# EAGLE design adpd2211_mixer (EAGLE 8.7.0)
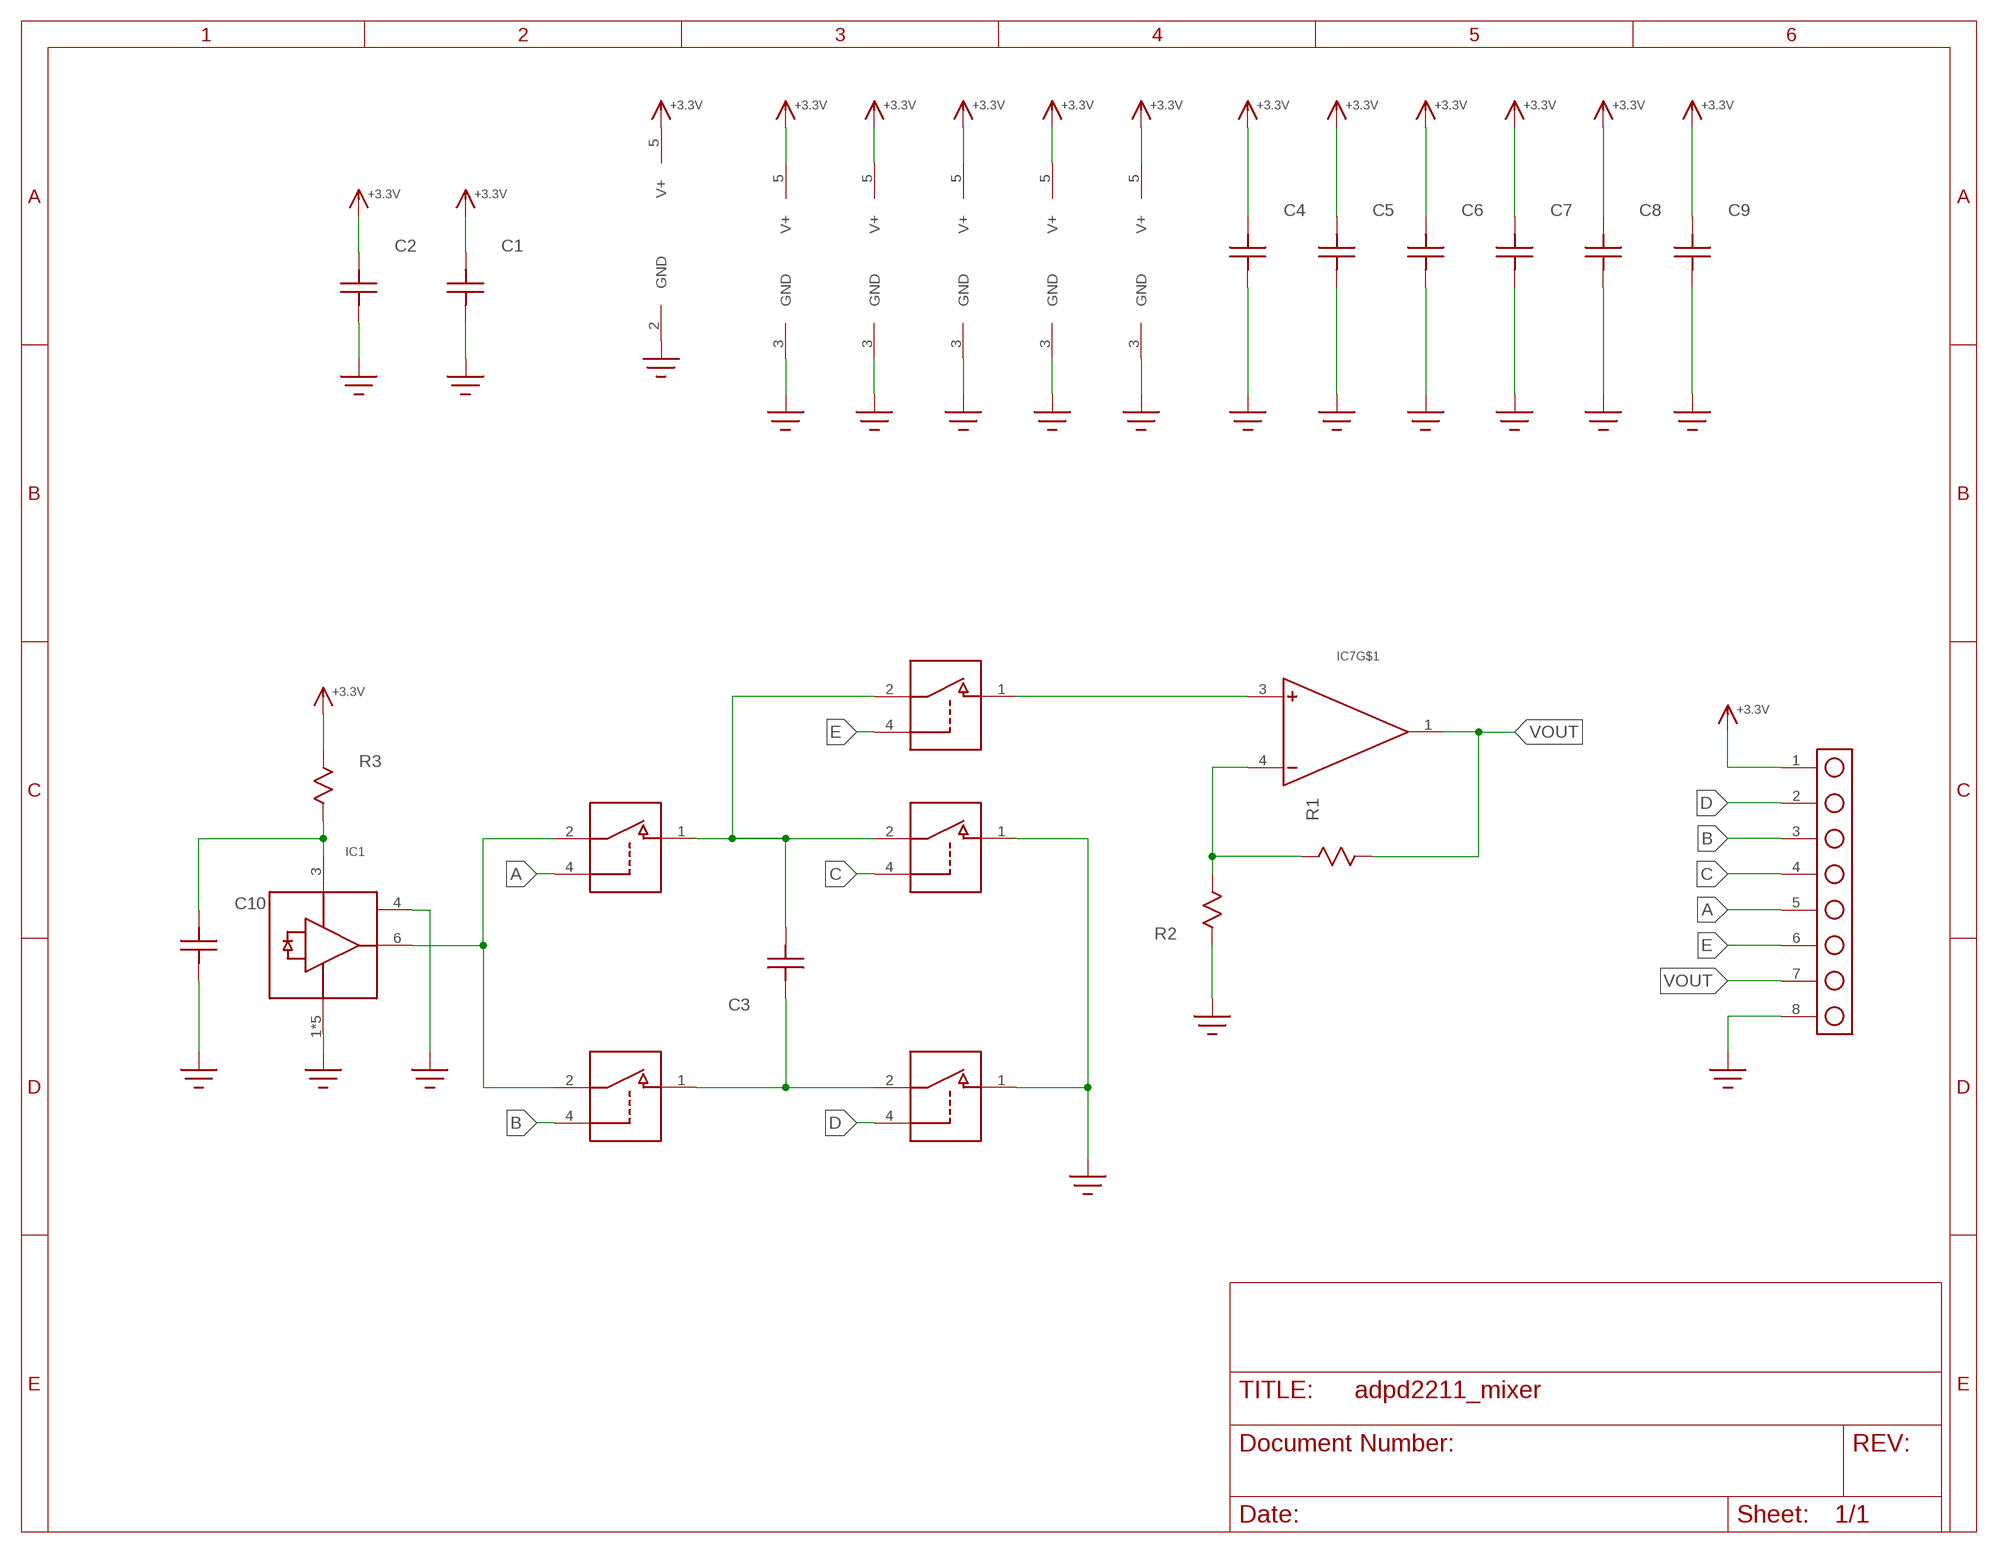
[diagram p0: schematic, sheet 1]

## Parts
C1  C1206  [1206]
C2  C0603  [C0603]
C3  C0805  [0805]
C4  C0603  [C0603]
C5  C0603  [C0603]
C6  C0603  [C0603]
C7  C0603  [C0603]
C8  C0603  [C0603]
C9  C0603  [C0603]
C10  C0603  [C0603]
IC1  ADPD2211  [LFCSP8]
IC2  TS5A3166  [SOT23-5]
IC3  TS5A3166  [SOT23-5]
IC4  TS5A3166  [SOT23-5]
IC5  TS5A3166  [SOT23-5]
IC6  TS5A3166  [SOT23-5]
IC7  AD8538  [SOT23-5]
J1  HEADER_8_PIN  [HEADER_8_PIN]
R1  R0603  [R0603]
R2  R0603  [R0603]
R3  R0603  [R0603]

## Nets
+3.3V: C1.P$2 C2.P$2 C4.P$2 C5.P$2 C6.P$2 C7.P$2 C8.P$2 C9.P$2 IC2.5(V+) IC3.5(V+) IC4.5(V+) IC5.5(V+) IC6.5(V+) IC7.5(V+) J1.1 R3.P$1
A: IC2.4(IN) J1.5
B: IC4.4(IN) J1.3
C: IC3.4(IN) J1.4
D: IC5.4(IN) J1.2
E: IC6.4(IN) J1.6
GND: C1.P$1 C2.P$1 C4.P$1 C5.P$1 C6.P$1 C7.P$1 C8.P$1 C9.P$1 C10.P$1 IC1.1(GND) IC1.2(GND) IC1.4(PWDN) IC1.5(GND) IC1.7(GND) IC1.8(GND) IC2.3(GND) IC3.1(NO) IC3.3(GND) IC4.3(GND) IC5.1(NO) IC5.3(GND) IC6.3(GND) IC7.2(GND) J1.8 R2.P$1
N$1: IC1.6(OUT) IC2.2(COM) IC4.2(COM)
N$2: C3.P$1 IC2.1(NO) IC3.2(COM) IC6.2(COM)
N$3: C3.P$2 IC4.1(NO) IC5.2(COM)
N$5: C10.P$2 IC1.3(VCC) R3.P$2
N$10: IC6.1(NO) IC7.3(+)
N$11: IC7.4(-) R1.P$1 R2.P$2
VOUT: IC7.1(OUT) J1.7 R1.P$2

## Library data of the parts
C1-C10 = ssir:C
IC1 = ssir:ADPD2211
IC2-IC6 = ssir:TS5A3166
IC7 = ssir:AD8538
J1 = ssir:HEADER_8_PIN
R1-R3 = ssir:R

## Board
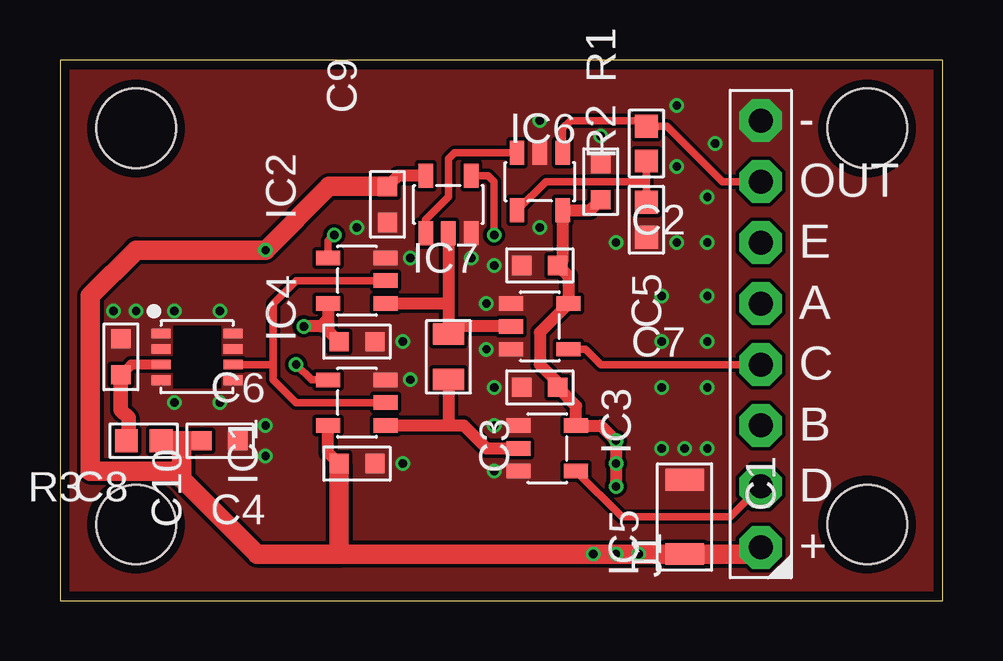
[diagram p1: board, top side]
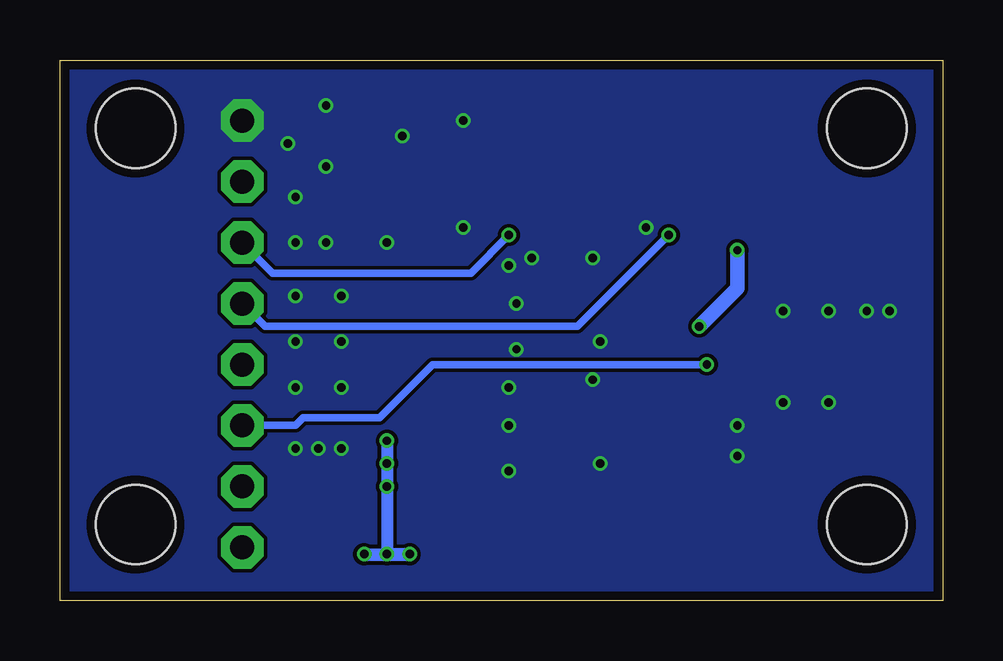
[diagram p2: board, bottom side, seen from below]

Size 36.81 x 22.53 mm. Coordinates in mm from the lower left corner, seen from the top.
Outline: 0,0 36.81,0 36.81,22.53 0,22.53 0,0
Copper layers (1*16): Top 0.035559375mm / dielectric 1.6mm / Bottom 0.035559375mm
Design rules "oshpark-2layer": minimum track width 6mil, minimum drill 10mil, track to track 6mil, track to pad 6mil, pad to pad 6mil, via to via 6mil, smd to smd 6mil, copper to edge 15mil, drill to drill 6mil, minimum pad ring 5mil, minimum via ring 5mil, stop-mask expansion 2.5mil, vias tented up to drill 0mil, thermal gap 10mil
Holes 3.3 mm at 3.17,3.17 3.17,19.68 33.66,19.68 33.66,3.17

### Footprints (pad centres in the part's own frame; a part is rotated, then mirrored left to right if it is on the bottom)
1206 = smd 0.9 x 1.6: P$1 -1.55,0; P$2 1.55,0
C0603 = smd 0.8 x 0.8: P$1 -0.75,0; P$2 0.75,0
0805 = smd 0.9 x 1.3: P$1 -0.95,0; P$2 0.95,0
LFCSP8 = smd 0.4 x 0.8: 1 -0.975,-1.5; 2 -0.325,-1.5; 3 0.325,-1.5; 4 0.975,-1.5; 5 0.975,1.5; 6 0.325,1.5; 7 -0.325,1.5; 8 -0.975,1.5
SOT23-5 = smd 0.6 x 1: 1 -0.95,-1.2; 2 0,-1.2; 3 0.95,-1.2; 4 0.95,1.2; 5 -0.95,1.2
HEADER_8_PIN = drill 1 pad 1.778 octagon: 1 -8.89,0; 2 -6.35,0; 3 -3.81,0; 4 -1.27,0; 5 1.27,0; 6 3.81,0; 7 6.35,0; 8 8.89,0
R0603 = smd 0.95 x 0.95: P$1 -0.725,0; P$2 0.725,0

### Placement (x,y rotation side)
C1  26.04,3.49 270 top
C2  20,13.97 0 top
C3  16.19,10.16 270 top
C4  12.38,5.71 180 top
C5  22.54,17.46 270 top
C6  12.38,10.79 180 top
C7  20,8.89 0 top
C8  6.67,6.67 180 top
C9  13.65,16.51 90 top
C10  2.54,10.16 270 top
IC1  5.71,10.16 270 top
IC2  12.38,13.34 90 top
IC3  20,11.43 270 top
IC4  12.38,8.26 90 top
IC5  20.32,6.35 270 top
IC6  16.19,16.51 0 top
IC7  20,17.46 180 top
J1  29.21,11.11 90 top
R1  24.45,19.05 90 top
R2  24.45,15.88 90 top
R3  3.49,6.67 180 top

### Tracks (layer width: path | path; a pad name or v marks a point on that pad's centre or on a via)
+3.3V  (via drill 0.35)
  Top 0.508: IC2.5 11.18,11.75 | 11.18,11.75 11.18,11.24 C6.P$2 | C4.P$2 11.18,6.17 IC4.5 | IC6.5 14.1,17.71 C9.P$2 | C5.P$2 22.09,16.26 IC7.5 20.95,14.17 C2.P$2 21.2,13.52 IC3.5 20,11.18 20,9.84 20.75,9.09 C7.P$2 21.52,8.12 IC5.5 22.55,7.3 v23.18,6.67 v23.18,5.71 v23.18,4.76 | 11.18,11.75 10.87,11.43 v10.16,11.43
  Top 0.813: 11.75,1.94 v23.18,1.94 C1.P$2 28.93,1.94 J1.1 | C4.P$2 11.63,2.06 11.75,1.94 | C9.P$2 11.23,17.26 v8.57,14.61 3.17,14.61 1.27,12.7 1.27,5.4 4.76,5.4 5.08,5.08 | R3.P$1 5.08,6.67 | 5.08,6.67 C8.P$2 | 5.08,5.08 8.22,1.94 11.75,1.94 | 5.08,6.67 5.08,5.08
  Bottom 0.508: v23.18,6.67 v23.18,5.71 v23.18,4.76 v23.18,1.94 | 23.18,1.91 v23.18,1.94 | v22.23,1.94 v23.18,1.94 | v24.13,1.94 v23.18,1.94
  Bottom 0.61: v10.16,11.43 8.57,13.02 v8.57,14.61
A  (via drill 0.35)
  Top 0.305: IC2.4 11.18,14.99 v11.43,15.24
  Bottom 0.305: J1.5 28.26,11.43 15.24,11.43 v11.43,15.24
B  (via drill 0.35)
  Top 0.305: IC4.4 10.48,9.21 v9.84,9.84
  Bottom 0.305: v9.84,9.84 21.27,9.84 23.5,7.62 26.67,7.62 26.99,7.3 J1.3
C
  Top 0.305: IC3.4 21.91,10.48 22.54,9.84 J1.4
D
  Top 0.305: IC5.4 23.43,3.49 27.94,3.49 J1.2
E  (via drill 0.35)
  Top 0.305: IC6.4 17.85,17.71 18.1,17.46 v18.1,15.24
  Bottom 0.305: v18.1,15.24 19.68,13.65 27.94,13.65 J1.6
GND  (via drill 0.35)
  other vias: 26.04,6.35 26.99,6.35 25.08,6.35 3.17,12.06 4.76,8.26 6.67,8.26 6.67,12.06 4.76,12.06 14.29,10.79 14.29,5.71 12.38,15.56 22.54,19.37 18.1,13.97 18.1,8.89 14.61,9.21 14.61,14.29 17.14,14.29 20,15.56 17.78,10.48 18.1,5.4 18.1,7.3 17.78,12.38 20,20 25.72,14.92 23.18,14.92 25.08,12.7 26.99,12.7 25.08,10.79 26.99,10.79 25.08,8.89 26.99,8.89 26.99,16.83 27.3,19.05 25.72,18.1 25.72,20.64 26.99,14.92 8.57,7.3 8.57,6.03 2.22,12.06
  pour Bottom (no thermals): 0,0 36.83,0 36.83,22.54 0,22.54
  pour Top (no thermals): 0,0 36.83,0 36.83,22.54 0,22.54
N$1
  Top 0.305: IC1.6 8.88,9.84 | 8.88,9.84 8.89,9.84 8.89,12.38 9.84,13.34 IC2.2 | 8.88,9.84 8.88,9.21 9.84,8.26 IC4.2
N$2
  Top 0.305: C3.P$1 16.67,11.43
  Top 0.508: IC6.2 16.19,12.38 | 16.19,12.38 C3.P$1 16.51,11.43 IC3.2 | IC2.1 16.19,12.38
N$3
  Top 0.508: IC4.1 16.19,7.3 | 16.19,7.3 16.82,7.3 17.78,6.35 IC5.2 | C3.P$2 16.19,7.3
N$4
  Bottom 0.508: 22.23,1.91 24.13,1.91
N$5
  Top 0.406: IC1.3 2.96,9.84 C10.P$2
  Top 0.61: C10.P$2 2.54,7.94 2.86,7.62 2.86,6.76 R3.P$2
N$10
  Top 0.305: IC6.1 15.24,15.88 16.19,16.83 16.19,18.41 16.44,18.66 IC7.3
N$11
  Top 0.305: R1.P$1 24.45,17.46 | 24.45,17.46 R2.P$2 | IC7.4 20.25,17.46 24.45,17.46
VOUT
  Top 0.305: IC7.1 20.95,19.68 21.27,20 24.22,20 R1.P$2 25.31,19.77 27.62,17.46 J1.7

### Text on the board
tPlace: - | OUT | E | A | C | B | D | +